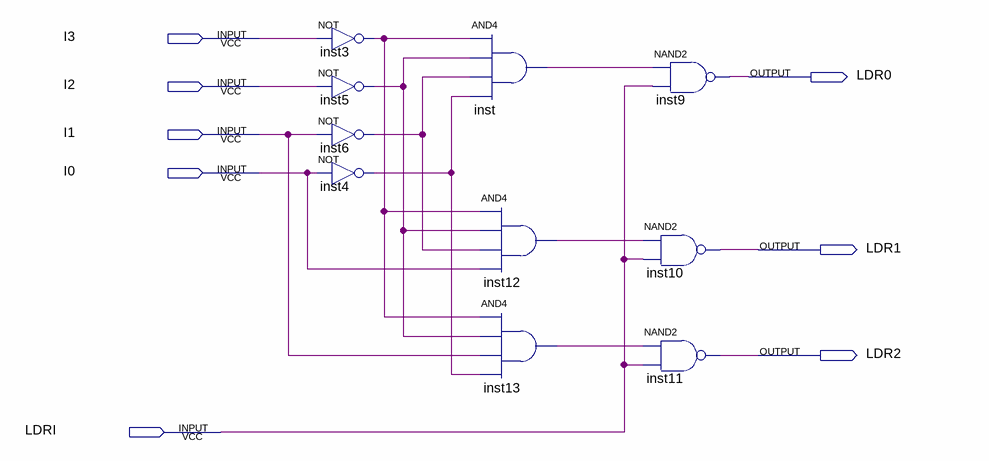
[diagram p0: schematic sheet]
// Quartus schematic ldr0_2.bdf as structural Verilog: 10 symbols, 8 pins
module ldr0_2 (
  input  I3,
  input  I2,
  input  I1,
  input  I0,
  input  LDRI,
  output LDR0,
  output LDR1,
  output LDR2
);

  wire inst3_out, inst4_out, inst5_out, inst6_out, inst12_out, inst13_out, inst_out;

  not inst3 (inst3_out, I3);
  not inst5 (inst5_out, I2);
  not inst6 (inst6_out, I1);
  not inst4 (inst4_out, I0);
  and inst (inst_out, inst3_out, inst5_out, inst6_out, inst4_out);
  and inst12 (inst12_out, inst3_out, inst5_out, inst6_out, I0);
  and inst13 (inst13_out, inst3_out, inst5_out, I1, inst4_out);
  nand inst9 (LDR0, inst_out, LDRI);
  nand inst10 (LDR1, inst12_out, LDRI);
  nand inst11 (LDR2, inst13_out, LDRI);
endmodule
